# EAGLE design M105X (EAGLE 6.6.0)
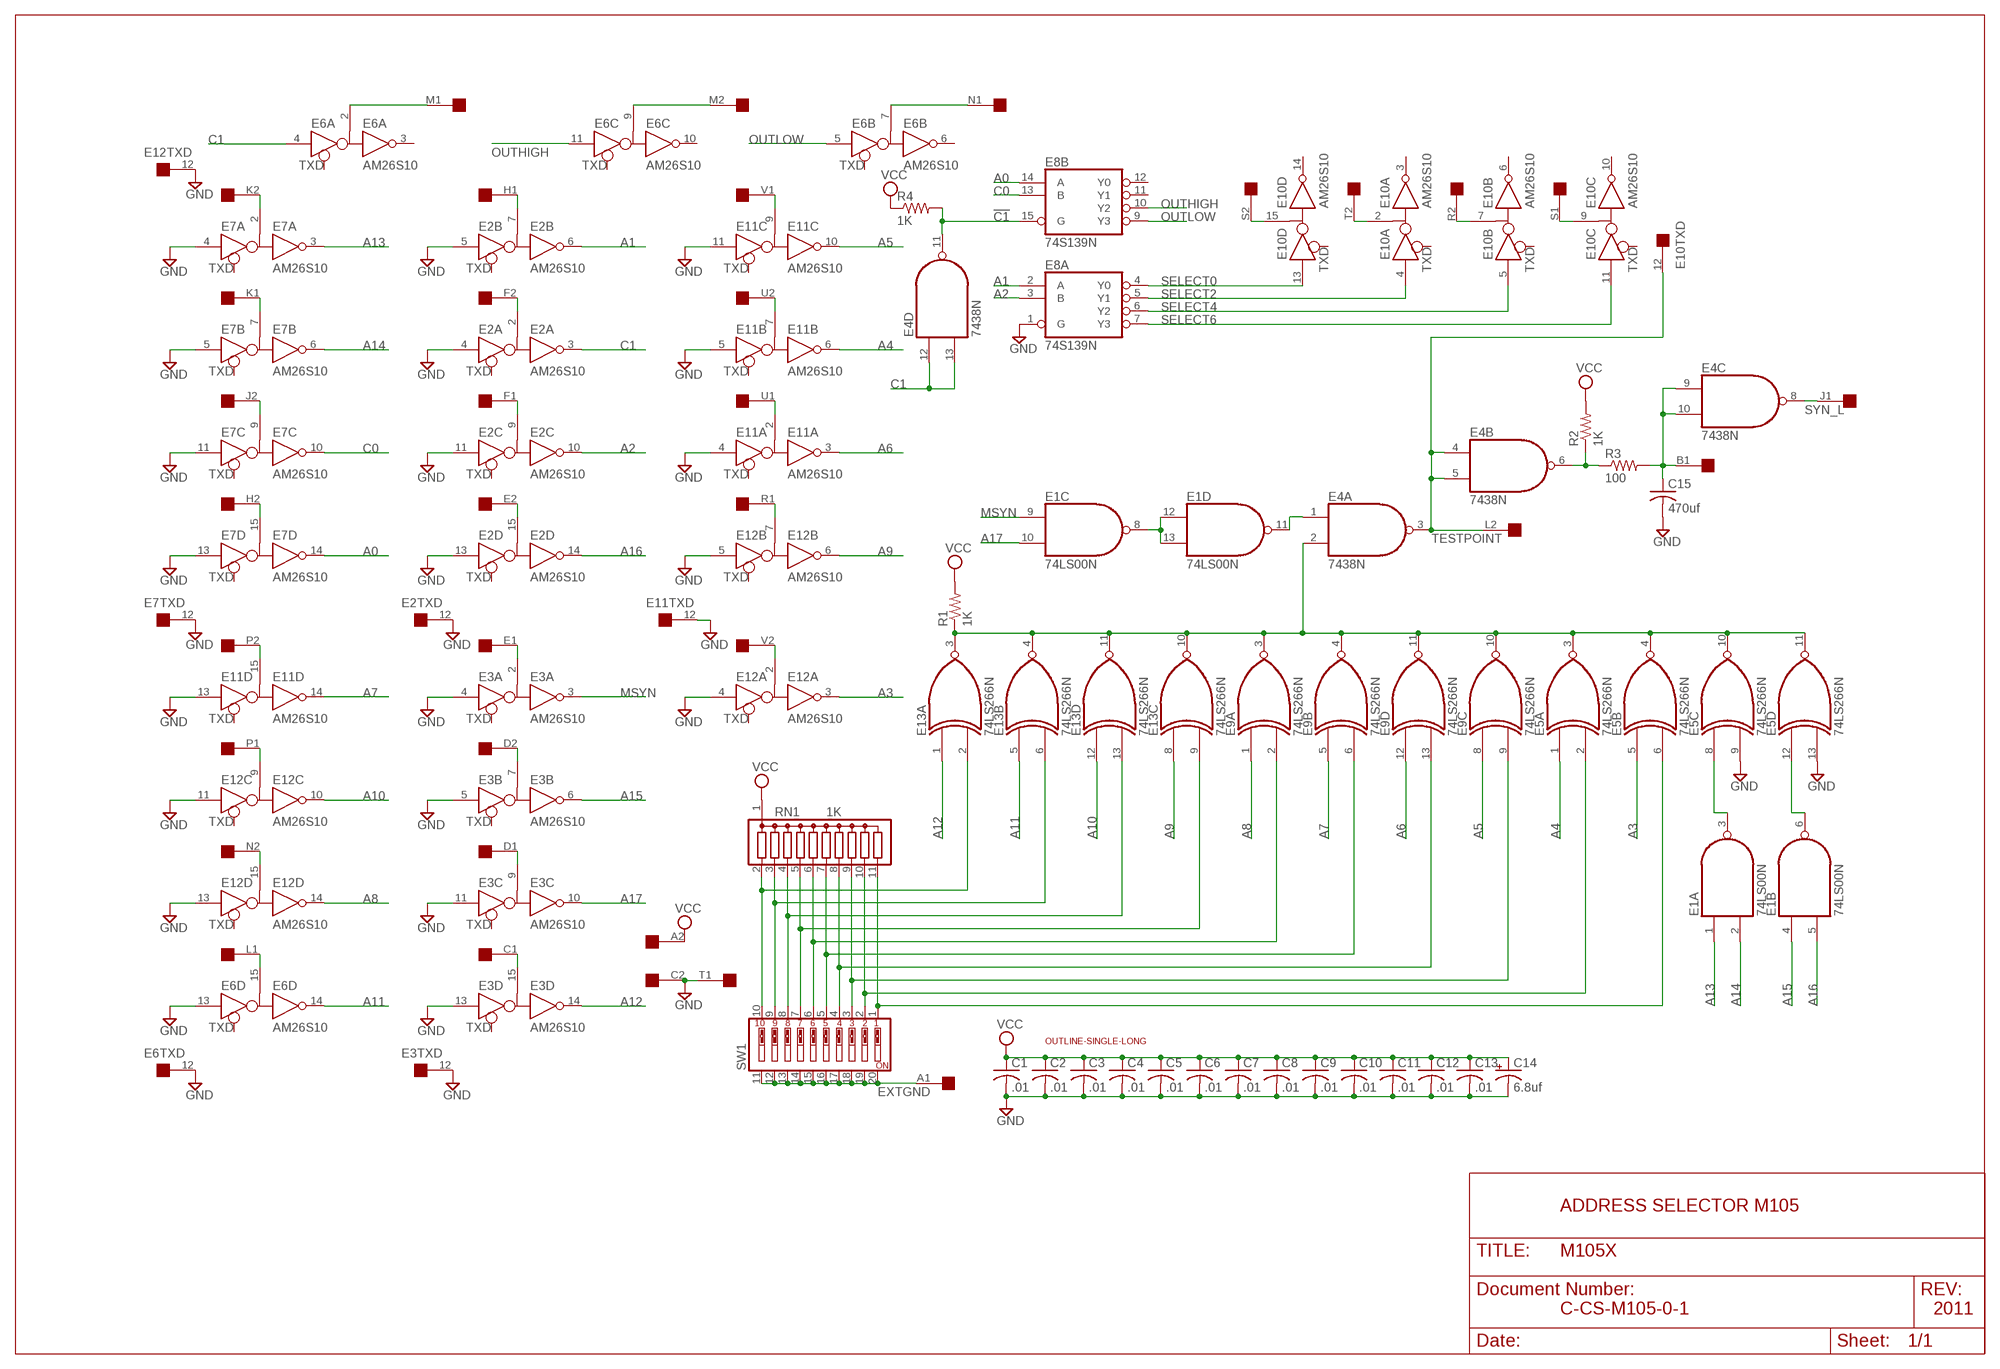
[diagram p0: schematic, sheet 1]

## Parts
C1  .01  C-US050-025X075  [C050-025X075]
C2  .01  C-US050-025X075  [C050-025X075]
C3  .01  C-US050-025X075  [C050-025X075]
C4  .01  C-US050-025X075  [C050-025X075]
C5  .01  C-US050-025X075  [C050-025X075]
C6  .01  C-US050-025X075  [C050-025X075]
C7  .01  C-US050-025X075  [C050-025X075]
C8  .01  C-US050-025X075  [C050-025X075]
C9  .01  C-US050-025X075  [C050-025X075]
C10  .01  C-US050-025X075  [C050-025X075]
C11  .01  C-US050-025X075  [C050-025X075]
C12  .01  C-US050-025X075  [C050-025X075]
C13  .01  C-US050-025X075  [C050-025X075]
C14  6.8uf  CPOL-USE15-5AXIAL  [E15-5]
C15  470uf  C-US050-025X075  [C050-025X075]
E1  74LS00N  [DIL14]
E2  AM26S10  [DIL16]
E3  AM26S10  [DIL16]
E4  7438N  [DIL14]
E5  74LS266N  [DIL14]
E6  AM26S10  [DIL16]
E7  AM26S10  [DIL16]
E8  74S139N  [DIL16]
E9  74LS266N  [DIL14]
E10  AM26S10  [DIL16]
E11  AM26S10  [DIL16]
E12  AM26S10  [DIL16]
E13  74LS266N  [DIL14]
R1  1K  R-US_0207/10  [0207/10]
R2  1K  R-US_0207/10  [0207/10]
R3  100  R-US_0207/10  [0207/10]
R4  1K  R-US_0207/10  [0207/10]
RN1  1K  G10R  [SIL11]
SW1  SW_DIP-10  [EDG-10]
U$1  SINGLE  [EDGE-CON2]
U$2  OUTLINE-SINGLE-LONG  [SINGLE-LONG]

## Nets
!C1: E4.11(D:O) E8.15(B:G) R4.2
A0: E7.14(D:R) E8.14(B:A)
A1: E2.6(B:R) E8.2(A:A)
A2: E2.10(C:R) E8.3(A:B)
A3: E5.5(B:I0) E12.3(A:R)
A4: E5.1(A:I0) E11.6(B:R)
A5: E9.8(C:I0) E11.10(C:R)
A6: E9.12(D:I0) E11.3(A:R)
A7: E9.5(B:I0) E11.14(D:R)
A8: E9.1(A:I0) E12.14(D:R)
A9: E12.6(B:R) E13.8(C:I0)
A10: E12.10(C:R) E13.12(D:I0)
A11: E6.14(D:R) E13.5(B:I0)
A12: E3.14(D:R) E13.1(A:I0)
A13: E1.1(A:I0) E7.3(A:R)
A14: E1.2(A:I1) E7.6(B:R)
A15: E1.4(B:I0) E3.6(B:R)
A16: E1.5(B:I1) E2.14(D:R)
A17: E1.10(C:I1) E3.10(C:R)
C0: E7.10(C:R) E8.13(B:B)
C1: E2.3(A:R) E4.12(D:I0) E4.13(D:I1) E6.4(A:D)
EXTGND: SW1.11 SW1.12 SW1.13 SW1.14 SW1.15 SW1.16 SW1.17 SW1.18 SW1.19 SW1.20 U$1.A1
GND [Supply]: C1.2 C2.2 C3.2 C4.2 C5.2 C6.2 C7.2 C8.2 C9.2 C10.2 C11.2 C12.2 C13.2 C14.- C15.2 E2.4(A:D) E2.5(B:D) E2.11(C:D) E2.12(TXD:TXD) E2.13(D:D) E3.4(A:D) E3.5(B:D) E3.11(C:D) E3.12(TXD:TXD) E3.13(D:D) E5.9(C:I1) E5.13(D:I1) E6.12(TXD:TXD) E6.13(D:D) E7.4(A:D) E7.5(B:D) E7.11(C:D) E7.12(TXD:TXD) E7.13(D:D) E8.1(A:G) E11.4(A:D) E11.5(B:D) E11.11(C:D) E11.12(TXD:TXD) E11.13(D:D) E12.4(A:D) E12.5(B:D) E12.11(C:D) E12.12(TXD:TXD) E12.13(D:D) U$1.C2 U$1.T1
MSYN: E1.9(C:I0) E3.3(A:R)
N$1: E3.2(A:B) U$1.E1
N$2: E3.7(B:B) U$1.D2
N$3: E3.9(C:B) U$1.D1
N$4: E3.15(D:B) U$1.C1
N$5: E2.7(B:B) U$1.H1
N$6: E2.2(A:B) U$1.F2
N$7: E2.9(C:B) U$1.F1
N$8: E2.15(D:B) U$1.E2
N$9: E7.2(A:B) U$1.K2
N$10: E7.7(B:B) U$1.K1
N$11: E7.9(C:B) U$1.J2
N$12: E7.15(D:B) U$1.H2
N$13: E11.15(D:B) U$1.P2
N$14: E12.9(C:B) U$1.P1
N$15: E12.15(D:B) U$1.N2
N$16: E6.15(D:B) U$1.L1
N$17: E12.7(B:B) U$1.R1
N$18: E12.2(A:B) U$1.V2
N$19: E11.2(A:B) U$1.U1
N$20: E11.7(B:B) U$1.U2
N$21: E11.9(C:B) U$1.V1
N$22: E4.6(B:O) R2.1 R3.1
N$23: E10.15(D:B) U$1.S2
N$24: E10.2(A:B) U$1.T2
N$25: E10.7(B:B) U$1.R2
N$26: E10.9(C:B) U$1.S1
N$27: E6.2(A:B) U$1.M1
N$28: E6.9(C:B) U$1.M2
N$29: E1.3(A:O) E5.8(C:I0)
N$30: E1.6(B:O) E5.12(D:I0)
N$31: E1.8(C:O) E1.12(D:I0) E1.13(D:I1)
N$33: E5.6(B:I1) RN1.11 SW1.1
N$34: E5.2(A:I1) RN1.10 SW1.2
N$35: E9.9(C:I1) RN1.9 SW1.3
N$36: E9.13(D:I1) RN1.8 SW1.4
N$37: E9.6(B:I1) RN1.7 SW1.5
N$38: E9.2(A:I1) RN1.6 SW1.6
N$39: E13.9(C:I1) RN1.5 SW1.7
N$40: E13.13(D:I1) RN1.4 SW1.8
N$41: E13.6(B:I1) RN1.3 SW1.9
N$42: E13.2(A:I1) RN1.2 SW1.10
N$43: E4.2(A:I1) E5.3(A:O) E5.4(B:O) E5.10(C:O) E5.11(D:O) E9.3(A:O) E9.4(B:O) E9.10(C:O) E9.11(D:O) E13.3(A:O) E13.4(B:O) E13.10(C:O) E13.11(D:O) R1.1
N$44: C15.1 E4.9(C:I0) E4.10(C:I1) R3.2 U$1.B1
N$45: E6.7(B:B) U$1.N1
N$46: E1.11(D:O) E4.1(A:I0)
OUTHIGH: E6.11(C:D) E8.10(B:Y2)
OUTLOW: E6.5(B:D) E8.9(B:Y3)
SELECT0: E8.4(A:Y0) E10.13(D:D)
SELECT2: E8.5(A:Y1) E10.4(A:D)
SELECT4: E8.6(A:Y2) E10.5(B:D)
SELECT6: E8.7(A:Y3) E10.11(C:D)
SYN_L: E4.8(C:O) U$1.J1
TESTPOINT: E4.3(A:O) E4.4(B:I0) E4.5(B:I1) E10.12(TXD:TXD) U$1.L2
VCC [Supply]: C1.1 C2.1 C3.1 C4.1 C5.1 C6.1 C7.1 C8.1 C9.1 C10.1 C11.1 C12.1 C13.1 C14.+ R1.2 R2.2 R4.1 RN1.1 U$1.A2
Unconnected: E6.3(A:R) E6.6(B:R) E6.10(C:R) E8.11(B:Y1) E8.12(B:Y0) E10.3(A:R) E10.6(B:R) E10.10(C:R) E10.14(D:R) U$1.B2

## Notes on the sheet
- ADDRESS SELECTOR M105
- C-CS-M105-0-1 | 2011

## Power pins joined to a net without a drawn wire
GND: E1.7(P:GND) E2.1(GND:GND) E2.8(PWR:GND) E3.1(GND:GND) E3.8(PWR:GND) E4.7(P:GND) E5.7(P:GND) E6.1(GND:GND) E6.8(PWR:GND) E7.1(GND:GND) E7.8(PWR:GND) E8.8(P:GND) E9.7(P:GND) E10.1(GND:GND) E10.8(PWR:GND) E11.1(GND:GND) E11.8(PWR:GND) E12.1(GND:GND) E12.8(PWR:GND) E13.7(P:GND)
VCC: E1.14(P:VCC) E2.16(PWR:VCC) E3.16(PWR:VCC) E4.14(P:VCC) E5.14(P:VCC) E6.16(PWR:VCC) E7.16(PWR:VCC) E8.16(P:VCC) E9.14(P:VCC) E10.16(PWR:VCC) E11.16(PWR:VCC) E12.16(PWR:VCC) E13.14(P:VCC)

## Library data of the parts
C1-C13 C15 = rcl:C-US: CAPACITOR, American symbol
C14 = rcl:CPOL-US: POLARIZED CAPACITOR, American symbol
E1 = 74xx-us:74*00: Quad 2-input NAND gate
E2 E3 E6 E7 E10-E12 = dec-con:AM26S10: Bus Transceiver
E4 = dec-con:74*38: Quad 2-input NAND gate, open collector output
E5 E9 E13 = 74xx-us:74*266: Quadruple EXCLUSIVE-NOR (XNOR), open-collector
E8 = 74xx-us:74*139: Dual 2-line to 4-line DECODER/DEMULTIPLEXER
R1-R4 = rcl:R-US_: RESISTOR, American symbol
RN1 = resistor-sil:G10R: SIL RESISTOR; OC_FARNELL: unknown; OC_NEWARK: unknown
SW1 = special:SW_DIP-10: DIP SWITCH
U$1 = dec-con:SINGLE: Single-Height DEC board
U$2 = dec-con:OUTLINE-*: Board outlines for DEC boards.

## Net classes
1 Supply: width 0.813 mm

## Board
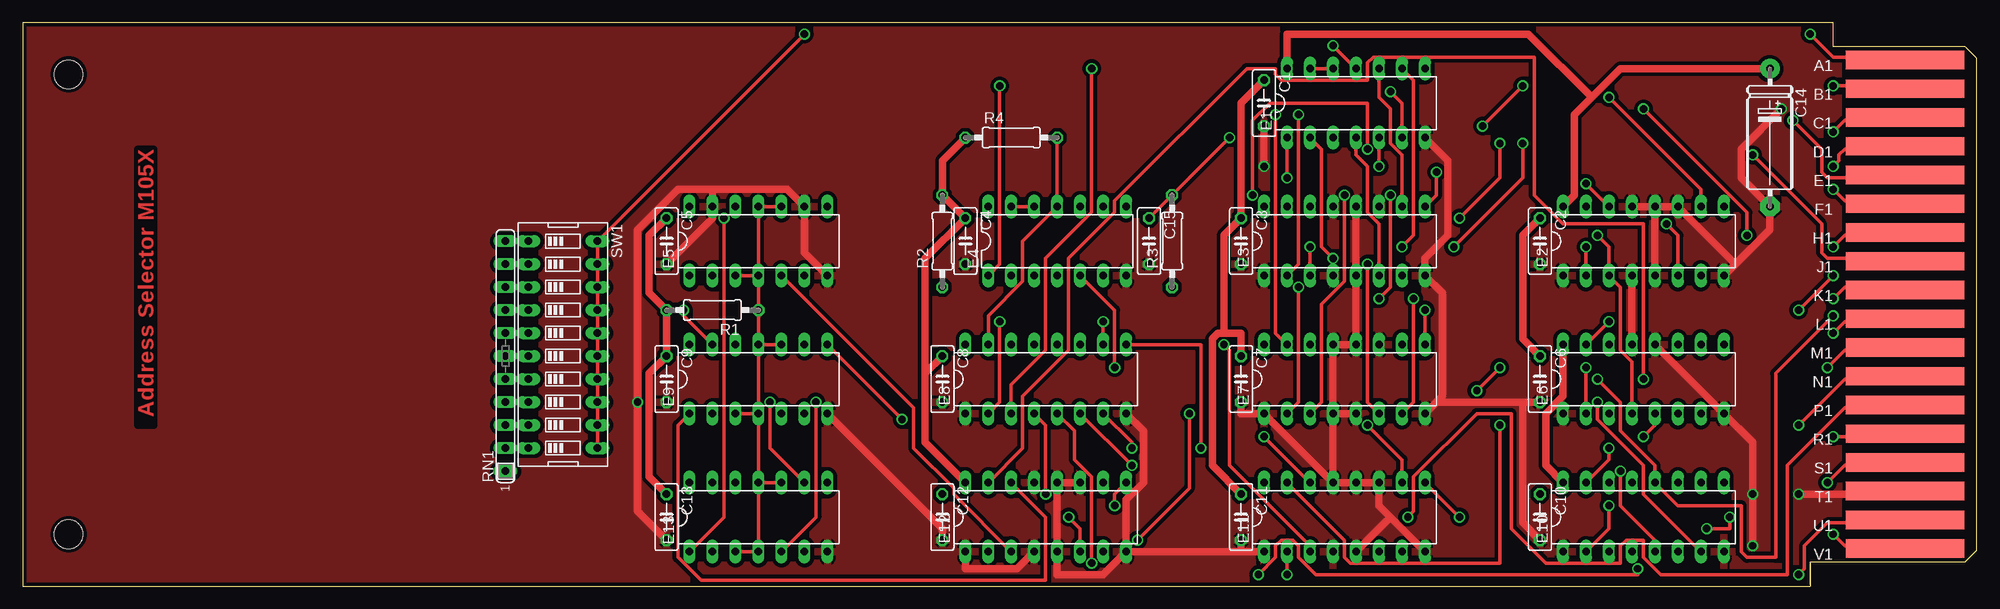
[diagram p1: board, top side]
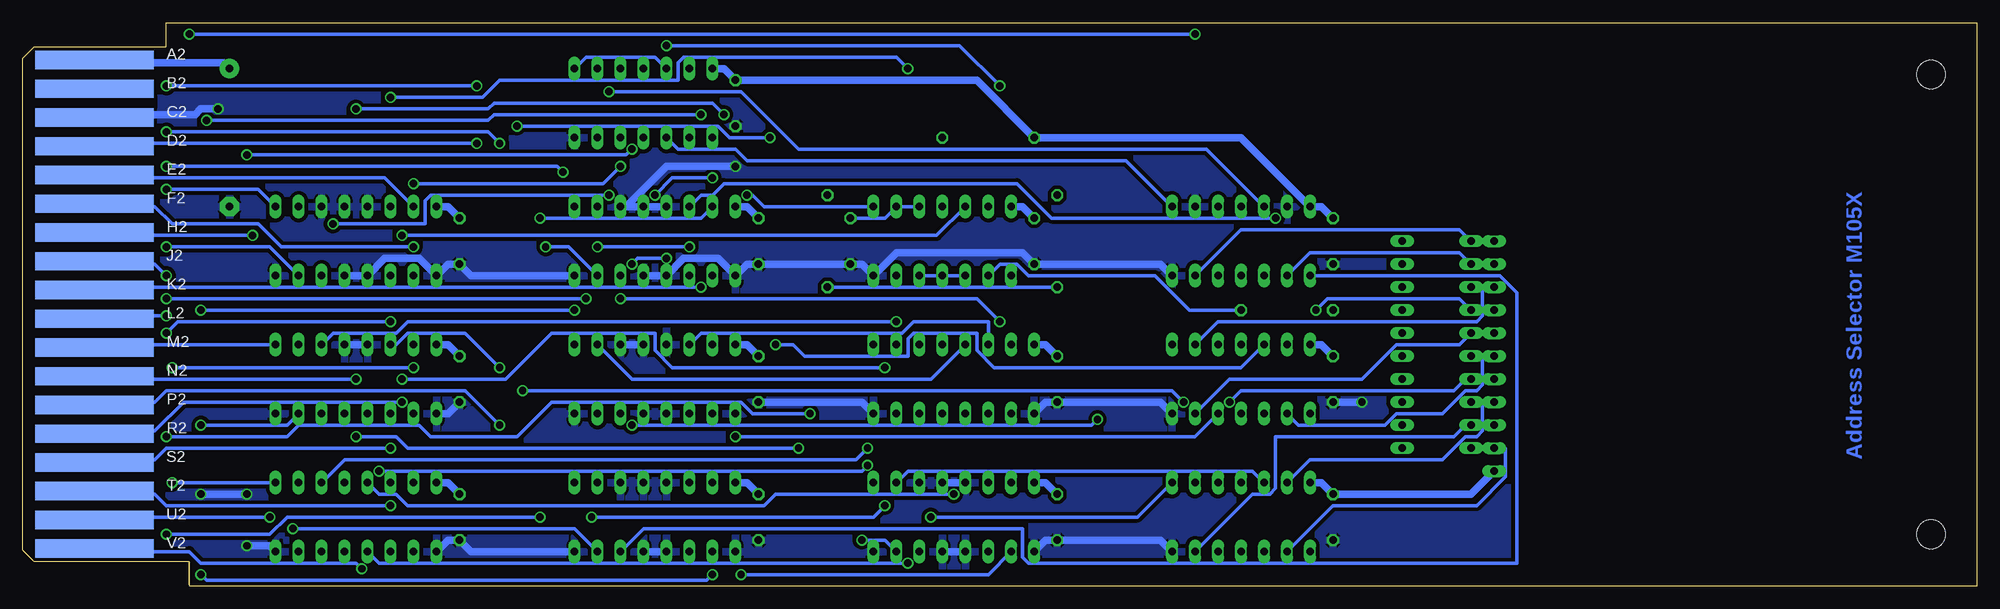
[diagram p2: board, bottom side, seen from below]

Size 215.9 x 62.23 mm. Coordinates in mm from the lower left corner, seen from the top.
Outline: 200.03,59.69 200.03,62.23
Copper layers (1+16): Top 0.035mm / dielectric 1.5mm / Bottom 0.035mm
Design rules "16mils": minimum track width 16mil, minimum drill 32mil, track to track 15mil, track to pad 10mil, pad to pad 10mil, via to via 10mil, smd to smd 10mil, copper to edge 13mil, drill to drill 10mil, minimum pad ring 10mil, minimum via ring 8mil, stop-mask expansion 0mil, vias tented up to drill 0mil, thermal gap 10mil

### Footprints (pad centres in the part's own frame; a part is rotated, then mirrored left to right if it is on the bottom)
C050-025X075 = drill 0.813 octagon: 1 -2.54,0; 2 2.54,0
E15-5 = drill 0.813 pad 2.159: + -7.62,0 | drill 0.813 pad 2.159 octagon: - 7.62,0
DIL14 = drill 0.813 long: 1 -7.62,-3.81; 2 -5.08,-3.81; 3 -2.54,-3.81; 4 0,-3.81; 5 2.54,-3.81; 6 5.08,-3.81; 7 7.62,-3.81; 8 7.62,3.81; 9 5.08,3.81; 10 2.54,3.81; 11 0,3.81; 12 -2.54,3.81; 13 -5.08,3.81; 14 -7.62,3.81
DIL16 = drill 0.813 long: 1 -8.89,-3.81; 2 -6.35,-3.81; 3 -3.81,-3.81; 4 -1.27,-3.81; 5 1.27,-3.81; 6 3.81,-3.81; 7 6.35,-3.81; 8 8.89,-3.81; 9 8.89,3.81; 10 6.35,3.81; 11 3.81,3.81; 12 1.27,3.81; 13 -1.27,3.81; 14 -3.81,3.81; 15 -6.35,3.81; 16 -8.89,3.81
0207/10 = drill 0.813 octagon: 1 -5.08,0; 2 5.08,0
SIL11 = drill 0.813 long: 1 -12.7,0; 2 -10.16,0; 3 -7.62,0; 4 -5.08,0; 5 -2.54,0; 6 0,0; 7 2.54,0; 8 5.08,0; 9 7.62,0; 10 10.16,0; 11 12.7,0
EDG-10 = drill 0.813 long: 1 -11.43,-3.81; 2 -8.89,-3.81; 3 -6.35,-3.81; 4 -3.81,-3.81; 5 -1.27,-3.81; 6 1.27,-3.81; 7 3.81,-3.81; 8 6.35,-3.81; 9 8.89,-3.81; 10 11.43,-3.81; 11 11.43,3.81; 12 8.89,3.81; 13 6.35,3.81; 14 3.81,3.81; 15 1.27,3.81; 16 -1.27,3.81; 17 -3.81,3.81; 18 -6.35,3.81; 19 -8.89,3.81; 20 -11.43,3.81
EDGE-CON2 = smd 13.106 x 2.032: A1 7.938,4.128; B1 7.938,7.303; C1 7.938,10.477; D1 7.938,13.652; E1 7.938,16.828; F1 7.938,20.003; H1 7.938,23.177; J1 7.938,26.352; K1 7.938,29.527; L1 7.938,32.703; M1 7.938,35.877; N1 7.938,39.053; P1 7.938,42.227; R1 7.938,45.403; S1 7.938,48.578; T1 7.938,51.752; U1 7.938,54.928; V1 7.938,58.102 | smd 13.106 x 2.032 bottom: A2 7.938,4.128; B2 7.938,7.303; C2 7.938,10.477; D2 7.938,13.652; E2 7.938,16.828; F2 7.938,20.003; H2 7.938,23.177; J2 7.938,26.352; K2 7.938,29.527; L2 7.938,32.703; M2 7.938,35.877; N2 7.938,39.053; P2 7.938,42.227; R2 7.938,45.403; S2 7.938,48.578; T2 7.938,51.752; U2 7.938,54.928; V2 7.938,58.102
SINGLE-LONG = hole 3.175: 210.82,56.515; 210.82,5.715

### Placement (x,y rotation side)
C1  137.16,53.34 270 top
C2  167.64,38.1 270 top
C3  134.62,38.1 270 top
C4  104.14,38.1 270 top
C5  71.12,38.1 270 top
C6  167.64,22.86 270 top
C7  134.62,22.86 270 top
C8  101.6,22.86 270 top
C9  71.12,22.86 270 top
C10  167.64,7.62 270 top
C11  134.62,7.62 270 top
C12  101.6,7.62 270 top
C13  71.12,7.62 270 top
C14  193.04,49.53 270 top
C15  124.46,38.1 270 top
E1  147.32,53.34 0 top
E2  179.07,38.1 0 top
E3  146.05,38.1 0 top
E4  114.3,38.1 0 top
E5  81.28,38.1 0 top
E6  179.07,22.86 0 top
E7  146.05,22.86 0 top
E8  113.03,22.86 0 top
E9  81.28,22.86 0 top
E10  179.07,7.62 0 top
E11  146.05,7.62 0 top
E12  113.03,7.62 0 top
E13  81.28,7.62 0 top
R1  76.2,30.48 180 top
R2  101.6,38.1 90 top
R3  127,38.1 90 top
R4  109.22,49.53 0 top
RN1  53.34,25.4 90 top
SW1  59.69,26.67 270 top
U$1  215.9,62.23 180 top
U$2  215.9,62.23 180 top

### Tracks (layer width: path | path; a pad name or v marks a point on that pad's centre or on a via)
!C1
  Top 0.406: E8.15 106.68,29.84 110.49,33.66 110.49,38.1 E4.11 R4.2
A0
  Bottom 0.406: E8.14 109.22,29.21 117.47,29.21 118.75,27.94 140.97,27.94 E7.14
A1  (via drill 0.81)
  Top 0.406: E8.2 107.95,20.32 v107.95,29.21 | v149.86,31.75 151.13,33.02 v151.13,43.18 | v181.61,40.01 182.88,38.73 E2.6
  Bottom 0.406: v107.95,29.21 110.49,31.75 v149.86,31.75 | v151.13,43.18 170.81,43.18 171.45,42.55 171.45,40.01 v181.61,40.01
A2  (via drill 0.81)
  Top 0.406: E8.3 109.22,22.23 113.03,26.04 113.03,36.2 118.11,41.27 v118.11,57.15 | v175.26,53.98 185.42,43.81 E2.10
  Bottom 0.406: v118.11,57.15 119.38,58.42 142.88,58.42 143.51,57.78 143.51,55.88 163.19,55.88 165.1,53.98 v175.26,53.98
A3
  Top 0.406: E12.3 102.87,10.16 102.87,10.79 98.42,15.24 98.42,19.68 E5.5
A4
  Bottom 0.406: E5.1 52.7,34.29 50.8,32.38 50.8,2.54 104.78,2.54 105.41,3.17 105.41,6.35 147.32,6.35 E11.6
A5  (via drill 0.81)
  Top 0.406: v97.16,18.41 E9.8 | v148.59,17.78 152.4,13.97 E11.10
  Bottom 0.406: v97.16,18.41 97.79,17.78 v148.59,17.78
A6  (via drill 0.81)
  Top 0.406: v132.72,26.67 133.35,26.04 133.35,13.34 142.24,4.45 E11.3
  Bottom 0.406: E9.12 81.28,24.13 108.58,24.13 110.49,26.04 110.49,27.94 117.47,27.94 118.11,27.3 118.11,25.4 129.54,25.4 130.81,26.67 v132.72,26.67
A7  (via drill 0.81)
  Top 0.406: E11.14 v137.16,16.51
  Bottom 0.406: E9.5 86.36,16.51 v137.16,16.51
A8
  Top 0.406: E9.1 72.39,17.78 72.39,3.17 74.93,0.64 113.03,0.64 113.03,7.62 E12.14
A9  (via drill 0.81)
  Top 0.406: v115.57,7.62 116.84,6.35 E12.6
  Bottom 0.406: E13.8 92.71,7.62 v115.57,7.62
A10
  Bottom 0.406: E13.12 80.01,12.7 118.11,12.7 E12.10
A11  (via drill 0.81)
  Top 0.406: E13.5 87.63,7.62 v87.63,20.32 | v163.19,24.13 v160.66,21.59
  Bottom 0.406: v87.63,20.32 88.9,21.59 v160.66,21.59 | v163.19,24.13 167,27.94 173.35,27.94 174.62,26.67 E6.14
A12  (via drill 0.81)
  Top 0.406: E13.1 77.47,7.62 v77.47,40.64
  Bottom 0.406: v77.47,40.64 102.23,40.64 106.05,44.45 138.43,44.45 139.7,43.18 140.97,43.18 E3.14
A13  (via drill 0.81)
  Top 0.406: E7.3 143.51,20.32 143.51,31.11 146.05,33.66 v146.05,43.18 | E1.1 v139.7,45.09
  Bottom 0.406: v146.05,43.18 144.15,45.09 v139.7,45.09
A14  (via drill 0.81)
  Top 0.406: E7.6 148.59,20.32 v148.59,35.56 | v144.78,36.2 143.51,37.47 143.51,48.26 E1.2
  Bottom 0.406: v148.59,35.56 147.96,36.2 v144.78,36.2
A15
  Top 0.406: E3.6 149.86,40.01 148.59,41.27 148.59,46.35 147.32,47.62 E1.4
A16  (via drill 0.81)
  Top 0.406: v149.86,46.35 E1.5 | E2.14 v172.72,44.45
  Bottom 0.406: v149.86,46.35 151.76,44.45 v172.72,44.45
A17
  Top 0.406: E3.10 152.4,47.62 151.13,48.9 151.13,52.7 149.86,53.98 E1.10
C0
  Bottom 0.406: E8.13 115.57,22.86 148.59,22.86 E7.10
C1  (via drill 0.81)
  Top 0.406: E4.12 E4.13 | E6.4 177.8,24.77 176.53,26.04 176.53,33.02 E2.3 175.26,37.47 v173.99,38.73
  Bottom 0.406: E4.12 114.94,38.73 v173.99,38.73
EXTGND  (via drill 0.81)
  Top 0.406: SW1.11 SW1.12 SW1.13 SW1.14 SW1.15 SW1.16 SW1.17 SW1.18 SW1.19 SW1.20 v86.36,60.96 | v197.49,60.96 200.03,58.42 207.65,58.42 U$1.A1
  Bottom 0.406: v197.49,60.96 v86.36,60.96
GND  (via drill 0.81)
  Top 0.813: 156.21,20.32 156.84,20.95 156.84,32.38 E3.8 154.94,36.2 157.48,38.73 157.48,46.99 E1.7 | 156.21,20.32 E7.8 | 156.21,20.32 165.74,20.32 | 165.74,20.32 C6.2 | v191.13,4.45 v191.13,10.16 191.13,15.88 E6.8 E6.12 | 189.23,35.56 193.04,39.37 C14.- 189.87,45.09 189.87,48.26 v194.31,52.7 | 189.23,35.56 E2.8 | E2.12 E2.13 | E2.12 E2.11 189.23,35.56 | E2.4 E6.13 | E2.5 E2.12 | v196.22,10.16 207.65,10.16 U$1.T1 | E5.7 86.36,36.83 E5.9 84.45,43.81 76.2,43.81 | C13.2 67.94,8.26 v67.94,20.32 67.94,39.37 72.39,43.81 76.2,43.81 | 76.2,43.81 E5.13 76.2,40.64 C5.2 | 134.62,3.81 E12.8 | C11.2 134.62,3.81 | 134.62,3.81 E11.1 | E12.11 E12.12 E12.5 114.3,1.27 119.38,1.27 E12.8 | E12.4 109.86,1.91 104.14,1.91 E12.1 | E9.7 101.6,6.35 C12.2 | v137.16,46.35 C1.2 | E3.12 E3.5 E7.12 E7.13 E7.4 | C7.2 134.62,19.05 E7.1 E11.13 | E7.5 E7.4 | E11.13 E11.12 E11.11 149.86,8.89 151.13,7.62 | 151.13,7.62 E11.8 | 151.13,7.62 E11.5 | E11.13 E7.4 | E12.8 121.92,9.53 123.83,11.43 123.83,17.14 E8.8 | 165.74,20.32 165.74,6.99 C10.2
  Bottom 0.813: C6.2 168.91,19.05 E6.1 | E3.8 166.37,34.29 C2.2 168.91,35.56 E2.1 172.09,36.2 175.9,36.2 E2.4 E2.5 | E10.8 188.59,4.45 v191.13,4.45 | E6.12 E6.13 | v191.13,10.16 v196.22,10.16 | v194.31,52.7 196.22,52.7 196.85,52.07 207.65,52.07 U$1.C2 | E5.7 90.17,35.56 C4.2 105.41,36.83 119.38,36.83 E4.7 123.19,35.56 C15.2 C3.2 135.89,35.56 E3.1 139.06,36.2 142.88,36.2 E3.4 E3.5 | v67.94,20.32 C9.2 | E9.7 90.17,20.32 C8.2 102.87,20.32 E8.1 | E12.5 E12.4 | E12.12 E12.13 | E13.7 90.17,5.08 C12.2 102.87,5.08 E12.1 | E3.13 E3.12 149.22,41.91 | v137.16,46.35 144.78,46.35 149.22,41.91 | 149.22,41.91 E3.11 | E8.8 123.19,20.32 C7.2 | E7.12 E7.11 | E10.1 168.91,5.08 C10.2 166.37,3.81 E11.8 | E11.5 E11.4
  pour Bottom (isolate 0.406): 200.66,62.23 0,62.23 0,0 200.66,0
  pour Top (isolate 0.406): 200.66,62.23 0,62.23 0,0 200.66,0
MSYN  (via drill 0.81)
  Top 0.406: v142.24,37.47 E3.3 | v152.4,37.47 153.67,38.73 153.67,55.88 E1.9
  Bottom 0.406: v152.4,37.47 v142.24,37.47
N$1  (via drill 0.81)
  Top 0.406: E3.2 140.97,35.56 v140.97,52.07 | v195.58,51.44 198.75,48.26 198.75,45.72 199.39,45.09 207.65,45.09 U$1.E1
  Bottom 0.406: v140.97,52.07 163.83,52.07 164.47,51.44 v195.58,51.44
N$2  (via drill 0.81)
  Top 0.406: v158.12,37.47 165.74,45.09 v165.74,48.9
  Bottom 0.406: E3.7 155.57,37.47 v158.12,37.47 | v165.74,48.9 207.65,48.9 U$1.D2
N$3  (via drill 0.81)
  Top 0.406: E3.9 156.21,43.18 v156.21,45.72 | v200.03,46.35 200.66,46.99 200.66,47.62 201.29,48.26 207.65,48.26 U$1.D1
  Bottom 0.406: v156.21,45.72 156.84,46.35 v200.03,46.35
N$4  (via drill 0.81)
  Top 0.406: v158.75,40.64 163.19,45.09 v163.19,48.9 | v200.03,50.16 201.29,51.44 207.65,51.44 U$1.C1
  Bottom 0.406: E3.15 140.97,40.64 v158.75,40.64 | v163.19,48.9 164.47,50.16 v200.03,50.16
N$5  (via drill 0.81)
  Top 0.406: v200.03,37.47 201.29,38.73 207.65,38.73 U$1.H1
  Bottom 0.406: E2.7 188.59,37.47 v200.03,37.47
N$6  (via drill 0.81)
  Top 0.406: v172.72,37.47 E2.2
  Bottom 0.406: v172.72,37.47 187.32,37.47 189.87,40.01 199.39,40.01 201.29,41.91 207.65,41.91 U$1.F2
N$7  (via drill 0.81)
  Top 0.406: v200.03,43.81 201.29,42.55 207.65,42.55 U$1.F1
  Bottom 0.406: E2.9 189.87,43.81 v200.03,43.81
N$8
  Bottom 0.406: E2.15 175.9,45.09 207.65,45.09 U$1.E2
N$9  (via drill 0.81)
  Top 0.406: E7.2 140.97,20.32 v140.97,33.02
  Bottom 0.406: v140.97,33.02 207.65,33.02 U$1.K2
N$10  (via drill 0.81)
  Top 0.406: E7.7 153.67,20.32 v153.67,31.75 | v200.03,31.75 201.29,33.02 207.65,33.02 U$1.K1
  Bottom 0.406: v200.03,31.75 v153.67,31.75
N$11  (via drill 0.81)
  Top 0.406: v154.94,30.48 E7.9 | v200.03,34.29 v196.22,30.48
  Bottom 0.406: v196.22,30.48 v154.94,30.48 | v200.03,34.29 201.29,35.56 207.65,35.56 U$1.J2
N$12  (via drill 0.81)
  Top 0.406: E7.15 138.43,27.94 v138.43,52.07 | v179.07,52.7 190.5,41.27 v190.5,38.73
  Bottom 0.406: v138.43,52.07 139.7,53.34 163.83,53.34 164.47,52.7 v179.07,52.7 | v190.5,38.73 207.65,38.73 U$1.H2
N$13  (via drill 0.81)
  Top 0.406: E11.15 146.05,5.08 146.05,3.17 146.69,2.54 163.19,2.54 v163.19,17.78
  Bottom 0.406: v163.19,17.78 167,21.59 200.03,21.59 201.29,20.32 207.65,20.32 U$1.P2
N$14  (via drill 0.81)
  Top 0.406: E12.9 120.65,10.16 v120.65,8.89 | v153.03,7.62 153.67,8.26 153.67,12.06 160.66,19.05 164.47,19.05 164.47,6.35 168.28,2.54 176.53,2.54 176.53,4.45 177.16,5.08 179.07,5.08 179.07,3.17 180.97,1.27 194.94,1.27 194.94,13.34 201.29,19.68 207.65,19.68 U$1.P1
  Bottom 0.406: v120.65,8.89 121.92,7.62 v153.03,7.62
N$15  (via drill 0.81)
  Top 0.406: E12.15 110.49,15.24 110.49,20.95 115.57,26.04 115.57,36.2 120.65,41.27 120.65,42.55 135.25,57.15 138.43,57.15 138.43,56.52 139.06,55.88 148.59,55.88 148.59,57.78 149.22,58.42 167,58.42 167,43.18 170.18,40.01 179.07,40.01 v179.07,22.86
  Bottom 0.406: v179.07,22.86 207.65,22.86 U$1.N2
N$16  (via drill 0.81)
  Top 0.406: v175.26,29.21 E6.15 | v200.03,27.94 201.29,29.21 207.65,29.21 U$1.L1
  Bottom 0.406: v175.26,29.21 198.75,29.21 v200.03,27.94
N$17  (via drill 0.81)
  Top 0.406: v123.19,5.08 128.91,10.79 v128.91,19.05 | v200.03,16.51 207.65,16.51 U$1.R1
  Bottom 0.406: E12.7 120.65,5.08 v123.19,5.08 | v128.91,19.05 135.25,19.05 136.53,20.32 157.48,20.32 161.29,16.51 170.81,16.51 172.09,17.78 185.42,17.78 186.69,16.51 v200.03,16.51
N$18  (via drill 0.81)
  Top 0.406: v136.53,1.27 138.43,3.17 138.43,4.45 139.06,5.08 140.34,5.08 140.97,4.45 140.97,3.17 142.88,1.27 178.44,1.27 v178.44,1.91
  Bottom 0.406: E12.2 109.22,1.27 v136.53,1.27 | v178.44,1.91 179.07,2.54 196.22,2.54 197.49,3.81 207.65,3.81 U$1.V2
N$19  (via drill 0.81)
  Top 0.406: v139.7,1.27 E11.2 | v196.22,1.27 196.85,1.91 196.85,4.45 199.39,6.99 207.65,6.99 U$1.U1
  Bottom 0.406: v139.7,1.27 140.34,0.64 195.58,0.64 v196.22,1.27
N$20  (via drill 0.81)
  Top 0.406: v186.06,6.35 188.59,6.35 v188.59,7.62
  Bottom 0.406: E11.7 154.94,6.35 v186.06,6.35 | v188.59,7.62 207.65,7.62 U$1.U2
N$21  (via drill 0.81)
  Top 0.406: v158.75,7.62 E11.9 | v200.03,5.71 201.29,4.45 207.65,4.45 U$1.V1
  Bottom 0.406: v158.75,7.62 186.69,7.62 188.59,5.71 v200.03,5.71
N$22
  Bottom 0.406: R3.1 119.38,33.02 | 119.38,33.02 R2.1 | 119.38,33.02 E4.6
N$23  (via drill 0.81)
  Top 0.406: E10.15 175.26,13.97 v175.26,15.24
  Bottom 0.406: v175.26,15.24 200.03,15.24 201.29,13.97 207.65,13.97 U$1.S2
N$24  (via drill 0.81)
  Top 0.406: E10.2 175.26,6.35 v175.26,8.89
  Bottom 0.406: v175.26,8.89 200.03,8.89 201.29,10.16 207.65,10.16 U$1.T2
N$25  (via drill 0.81)
  Top 0.406: E10.7 179.07,10.16 179.07,13.34 173.99,18.41 v173.99,20.32
  Bottom 0.406: v173.99,20.32 198.12,20.32 201.29,17.14 207.65,17.14 U$1.R2
N$26  (via drill 0.81)
  Top 0.406: v199.39,11.43 201.29,13.34 207.65,13.34 U$1.S1
  Bottom 0.406: v199.39,11.43 E10.9
N$27  (via drill 0.81)
  Top 0.406: v172.72,24.13 E6.2 | v199.39,24.13 201.29,26.04 207.65,26.04 U$1.M1
  Bottom 0.406: v199.39,24.13 v172.72,24.13
N$28
  Bottom 0.406: E6.9 207.65,26.67 U$1.M2
N$29
  Bottom 0.406: E5.8 93.98,46.99 135.89,46.99 137.16,48.26 143.51,48.26 E1.3
N$30  (via drill 0.81)
  Top 0.406: v151.13,54.61 152.4,53.34 E1.6
  Bottom 0.406: E5.12 85.09,48.26 130.18,48.26 136.53,54.61 v151.13,54.61
N$31
  Top 0.406: E1.12 E1.13
  Bottom 0.406: E1.8 153.67,58.42 146.05,58.42 E1.12
N$33
  Top 0.406: SW1.1 RN1.11
  Bottom 0.406: E5.6 81.28,39.37 57.15,39.37 SW1.1
N$34
  Top 0.406: SW1.2 RN1.10
  Bottom 0.406: E5.2 73.66,36.83 57.15,36.83 SW1.2
N$35
  Top 0.406: SW1.3 RN1.9
  Bottom 0.406: E9.9 83.82,29.21 55.24,29.21 54.61,29.84 54.61,33.02 RN1.9
N$36  (via drill 0.81)
  Top 0.406: SW1.4 RN1.8 | E9.13 73.03,29.84 v73.03,30.48
  Bottom 0.406: v73.03,30.48 71.75,31.75 57.15,31.75 SW1.4
N$37
  Top 0.406: SW1.5 RN1.7
  Bottom 0.406: E9.6 82.55,22.86 67.94,22.86 64.14,26.67 57.15,26.67 SW1.5
N$38
  Top 0.406: SW1.6 RN1.6
  Bottom 0.406: E9.2 74.93,17.78 65.41,17.78 64.14,19.05 59.05,19.05 56.52,21.59 55.24,21.59 54.61,22.23 54.61,25.4 RN1.6
N$39  (via drill 0.81)
  Top 0.406: SW1.7 RN1.5 | E13.9 82.55,15.24 v82.55,20.32
  Bottom 0.406: v82.55,20.32 81.28,21.59 57.78,21.59 56.52,22.86 SW1.7
N$40
  Top 0.406: SW1.8 RN1.4
  Bottom 0.406: E13.13 73.66,13.97 59.05,13.97 56.52,16.51 55.24,16.51 54.61,17.14 54.61,20.32 RN1.4
N$41
  Top 0.406: SW1.9 RN1.3
  Bottom 0.406: E13.6 80.01,10.16 78.11,10.16 77.47,10.79 77.47,16.51 57.78,16.51 56.52,17.78 SW1.9
N$42
  Top 0.406: SW1.10 RN1.2
  Bottom 0.406: E13.2 71.12,8.89 55.24,8.89 52.07,12.06 52.07,15.24 RN1.2
N$43
  Top 0.406: E13.3 E13.4 E13.11 | E13.10 E13.11 | E9.4 E9.3 | E9.10 E9.11 | E9.11 E9.4 | E9.4 E13.11 | E5.10 E5.11 E5.4 | E5.4 R1.1 E9.11 | E5.4 E5.3
  Bottom 0.406: E4.2 107.95,35.56 106.05,35.56 104.78,34.29 90.81,34.29 87,30.48 R1.1
N$44  (via drill 0.81)
  Top 0.406: C15.1 R3.2 v133.35,49.53 | v165.74,55.24 v161.29,50.8 | v200.03,55.24 207.65,55.24 U$1.B1
  Bottom 0.406: E4.10 E4.9 120.65,40.64 C15.1 | v133.35,49.53 137.79,49.53 139.06,50.8 v161.29,50.8 | v200.03,55.24 v165.74,55.24
N$45  (via drill 0.81)
  Top 0.406: v196.22,17.78 201.29,22.86 207.65,22.86 U$1.N1
  Bottom 0.406: E6.7 186.69,17.78 v196.22,17.78
N$46  (via drill 0.81)
  Top 0.406: E4.1 107.95,35.56 v107.95,55.24 | E1.11 v144.78,59.69
  Bottom 0.406: v107.95,55.24 112.39,59.69 v144.78,59.69
OUTHIGH  (via drill 0.81)
  Top 0.406: v119.38,29.21 E8.10
  Bottom 0.406: v119.38,29.21 173.35,29.21 174.62,27.94 181.61,27.94 E6.11
OUTLOW  (via drill 0.81)
  Top 0.406: E8.9 130.18,26.67 v130.18,15.24 | v179.07,16.51 180.34,17.78 E6.5
  Bottom 0.406: v130.18,15.24 173.35,15.24 174.62,16.51 v179.07,16.51
SELECT0  (via drill 0.81)
  Top 0.406: E8.4 113.03,17.78 v113.03,10.16
  Bottom 0.406: v113.03,10.16 132.72,10.16 133.99,8.89 173.35,8.89 174.62,10.16 176.53,10.16 E10.13
SELECT2  (via drill 0.81)
  Top 0.406: E8.5 116.2,17.14 116.2,13.97 118.11,12.06 v118.11,2.54
  Bottom 0.406: v118.11,2.54 176.53,2.54 E10.4
SELECT4  (via drill 0.81)
  Top 0.406: v122.56,13.34 E8.6 | v176.53,12.7 176.53,8.89 180.34,5.08 E10.5
  Bottom 0.406: v122.56,13.34 123.19,12.7 v176.53,12.7
SELECT6  (via drill 0.81)
  Top 0.406: E8.7 122.56,15.88 v122.56,15.24
  Bottom 0.406: v122.56,15.24 123.83,13.97 180.34,13.97 E10.11
SYN_L  (via drill 0.81)
  Top 0.406: v135.89,43.18 135.89,51.44 137.79,53.34 148.59,53.34 v148.59,48.26 | v191.13,47.62 198.75,40.01 198.75,36.83 199.39,36.2 207.65,36.2 U$1.J1
  Bottom 0.406: E4.8 133.99,41.91 135.25,43.18 v135.89,43.18 | v148.59,48.26 149.22,47.62 v191.13,47.62
TESTPOINT  (via drill 0.81)
  Top 0.406: v200.03,29.84 193.68,23.5 193.68,3.17 190.5,3.17 189.87,3.81 189.87,8.89 182.88,8.89 E10.12 180.34,13.34 176.53,17.14 176.53,20.32 v173.99,22.86 | E4.5 120.65,30.48 v120.65,24.13
  Bottom 0.406: E4.3 E4.4 E4.5 | v200.03,29.84 207.65,29.84 U$1.L2 | v120.65,24.13 144.15,24.13 146.05,26.04 146.05,27.94 157.48,27.94 162.56,22.86 v173.99,22.86
VCC
  Top 0.813: E10.16 168.28,13.34 168.28,19.05 170.18,20.95 E6.16 | C2.1 165.74,38.73 165.74,27.3 C6.1 | E2.16 171.45,43.18 171.45,52.07 173.35,53.98 | 173.35,53.98 176.53,57.15 C14.+ | C5.1 69.22,38.73 69.22,32.38 R1.2 C9.1 69.22,23.5 69.22,12.06 C13.1 | R4.1 101.6,46.99 R2.2 C4.1 99.69,36.2 99.69,23.5 | E12.16 99.69,15.88 99.69,23.5 | C8.1 99.69,23.5 | C11.1 131.44,13.34 131.44,27.3 132.08,27.94 132.72,27.94 | 132.72,27.94 134.62,27.94 C7.1 | 132.72,27.94 132.72,38.73 C3.1 134.62,53.34 C1.1 | 173.35,53.98 166.37,60.96 139.7,60.96 E1.14
  Bottom 0.813: C2.1 168.91,41.91 E2.16 | C10.1 168.91,11.43 E10.16 | C6.1 168.91,26.67 E6.16 | C14.+ 193.68,57.78 207.65,57.78 U$1.A2 | C5.1 72.39,41.91 E5.14 81.28,49.53 R4.1 110.49,55.88 C1.1 138.43,57.15 E1.14 | C9.1 72.39,26.67 E9.14 | E13.14 72.39,11.43 C13.1 55.88,10.16 RN1.1 | C4.1 105.41,41.91 E4.14 | C12.1 102.87,11.43 E12.16 | C8.1 102.87,26.67 E8.16 | C3.1 135.89,41.91 E3.16 | C11.1 135.89,11.43 E11.16 | C7.1 135.89,26.67 E7.16

### Text on the board
Top: Address Selector M105X
Bottom: Address Selector M105X